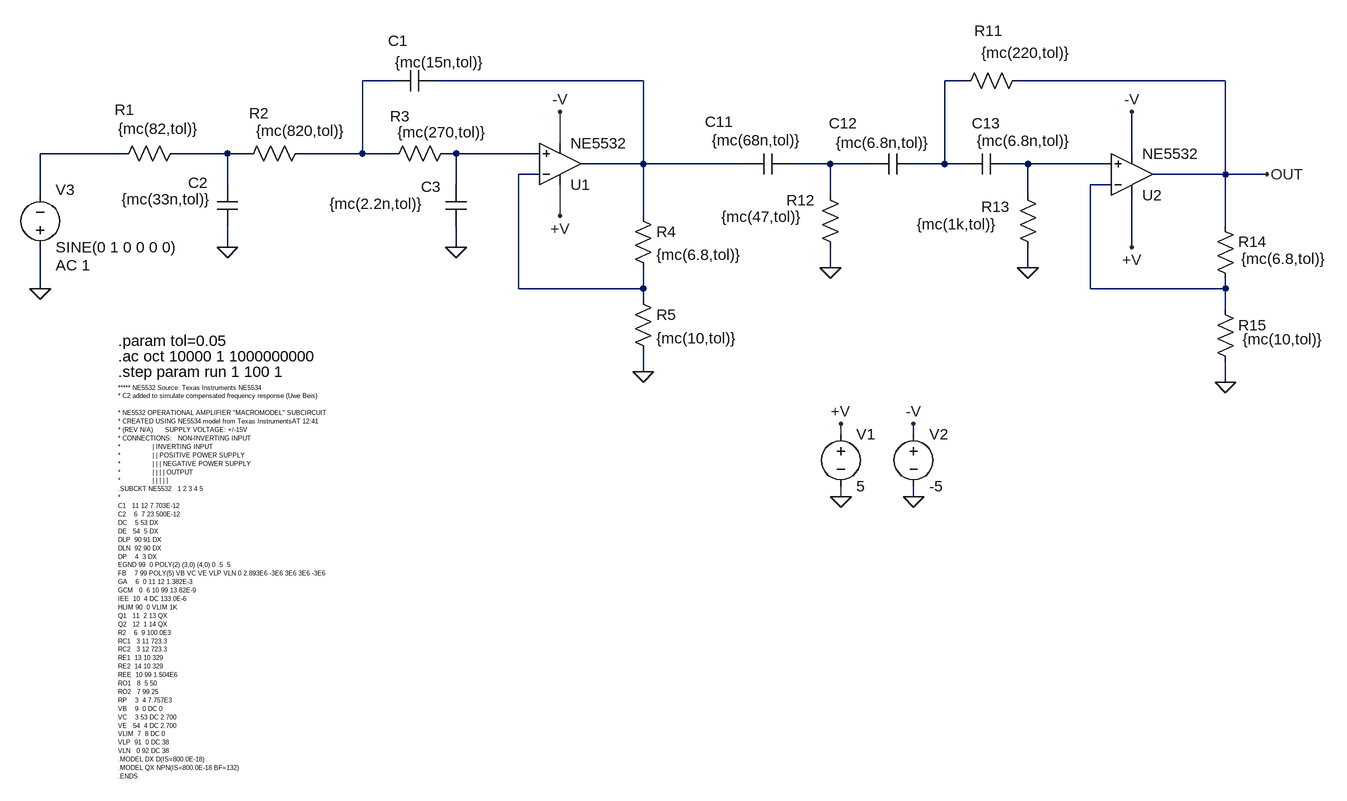
[diagram p0: schematic sallen-key-bp.asc]
sallen-key-bp.asc, the LTspice schematic file:
Version 4
SHEET 1 1432 1664
WIRE -80 -112 -128 -112
WIRE 304 -112 -16 -112
WIRE 800 -112 768 -112
WIRE 1200 -112 880 -112
WIRE 176 -16 176 -64
WIRE -496 0 -624 0
WIRE -336 0 -416 0
WIRE -304 0 -336 0
WIRE -128 0 -128 -112
WIRE -128 0 -224 0
WIRE -80 0 -128 0
WIRE 16 0 0 0
WIRE 144 0 16 0
WIRE 1056 0 1056 -64
WIRE 304 16 304 -112
WIRE 304 16 208 16
WIRE 464 16 304 16
WIRE 592 16 528 16
WIRE 656 16 592 16
WIRE 768 16 768 -112
WIRE 768 16 720 16
WIRE 800 16 768 16
WIRE 896 16 864 16
WIRE 1024 16 896 16
WIRE 144 32 112 32
WIRE 1200 32 1200 -112
WIRE 1200 32 1088 32
WIRE 1264 32 1200 32
WIRE -336 48 -336 0
WIRE 16 48 16 0
WIRE 1024 48 992 48
WIRE -624 64 -624 0
WIRE 592 64 592 16
WIRE 896 64 896 16
WIRE 176 96 176 48
WIRE 304 96 304 16
WIRE 1200 112 1200 32
WIRE -336 144 -336 112
WIRE 16 144 16 112
WIRE 1056 144 1056 64
WIRE 592 176 592 144
WIRE 896 176 896 144
WIRE -624 208 -624 144
WIRE 112 208 112 32
WIRE 304 208 304 176
WIRE 304 208 112 208
WIRE 992 208 992 48
WIRE 1200 208 1200 192
WIRE 1200 208 992 208
WIRE 304 224 304 208
WIRE 1200 240 1200 208
WIRE 304 336 304 304
WIRE 1200 352 1200 320
WIRE 608 432 608 416
WIRE 720 432 720 416
WIRE 608 528 608 512
WIRE 720 528 720 512
FLAG 608 528 0
FLAG 608 416 +V
FLAG 720 528 0
FLAG 720 416 -V
FLAG -624 208 0
FLAG 1264 32 OUT
FLAG 16 144 0
FLAG -336 144 0
FLAG 592 176 0
FLAG 896 176 0
FLAG 1056 144 +V
FLAG 1056 -64 -V
FLAG 1200 352 0
FLAG 304 336 0
FLAG 176 -64 -V
FLAG 176 96 +V
SYMBOL voltage 608 416 R0
SYMATTR InstName V1
SYMATTR Value 5
SYMBOL voltage -624 160 M180
WINDOW 0 24 104 Left 2
WINDOW 3 24 16 Left 2
WINDOW 123 24 -12 Left 2
WINDOW 39 0 0 Left 0
SYMATTR InstName V3
SYMATTR Value SINE(0 1 0 0 0 0)
SYMATTR Value2 AC 1
SYMBOL voltage 720 416 R0
SYMATTR InstName V2
SYMATTR Value -5
SYMBOL res -400 -16 R90
WINDOW 0 -36 94 VBottom 2
WINDOW 3 -38 42 VTop 2
SYMATTR InstName R1
SYMATTR Value {mc(82,tol)}
SYMBOL res -208 -16 R90
WINDOW 0 -30 79 VBottom 2
WINDOW 3 -35 15 VTop 2
SYMATTR InstName R2
SYMATTR Value {mc(820,tol)}
SYMBOL cap -320 112 R180
WINDOW 0 46 67 Left 2
WINDOW 3 41 42 Left 2
SYMATTR InstName C2
SYMATTR Value {mc(33n,tol)}
SYMBOL cap -16 -128 R90
WINDOW 0 -30 57 VBottom 2
WINDOW 3 -28 -7 VTop 2
SYMATTR InstName C1
SYMATTR Value {mc(15n,tol)}
SYMBOL res 16 -16 R90
WINDOW 0 -26 86 VBottom 2
WINDOW 3 -32 21 VTop 2
SYMATTR InstName R3
SYMATTR Value {mc(270,tol)}
SYMBOL cap 0 48 R0
WINDOW 0 -38 3 Left 2
WINDOW 3 -179 29 Left 2
SYMATTR InstName C3
SYMATTR Value {mc(2.2n,tol)}
SYMBOL cap 528 0 R90
WINDOW 0 -33 107 VBottom 2
WINDOW 3 -36 49 VTop 2
SYMATTR InstName C11
SYMATTR Value {mc(68n,tol)}
SYMBOL cap 720 0 R90
WINDOW 0 -31 108 VBottom 2
WINDOW 3 -32 47 VTop 2
SYMATTR InstName C12
SYMATTR Value {mc(6.8n,tol)}
SYMBOL res 576 48 R0
WINDOW 0 -52 24 Left 2
WINDOW 3 -152 49 Left 2
SYMATTR InstName R12
SYMATTR Value {mc(47,tol)}
SYMBOL res 880 48 R0
WINDOW 0 -56 34 Left 2
WINDOW 3 -155 61 Left 2
SYMATTR InstName R13
SYMATTR Value {mc(1k,tol)}
SYMBOL res 896 -128 R90
WINDOW 0 -45 60 VBottom 2
WINDOW 3 -43 3 VTop 2
SYMATTR InstName R11
SYMATTR Value {mc(220,tol)}
SYMBOL OpAmps\\opamp2 1056 96 M180
SYMATTR InstName U2
SYMATTR Value NE5532
SYMBOL res 1184 96 R0
WINDOW 3 40 66 Left 2
SYMATTR InstName R14
SYMATTR Value {mc(6.8,tol)}
SYMBOL res 1184 224 R0
WINDOW 3 43 62 Left 2
SYMATTR InstName R15
SYMATTR Value {mc(10,tol)}
SYMBOL OpAmps\\opamp2 176 80 M180
SYMATTR InstName U1
SYMATTR Value NE5532
SYMBOL res 288 80 R0
SYMATTR InstName R4
SYMATTR Value {mc(6.8,tol)}
SYMBOL res 288 208 R0
SYMATTR InstName R5
SYMATTR Value {mc(10,tol)}
SYMBOL cap 864 0 R90
WINDOW 0 -31 32 VBottom 2
WINDOW 3 -35 -26 VTop 2
SYMATTR InstName C13
SYMATTR Value {mc(6.8n,tol)}
TEXT -504 312 Left 2 !.ac oct 10000 1 1000000000
TEXT -504 360 Left 0 !***** NE5532 Source: Texas Instruments NE5534\n* C2 added to simulate compensated frequency response (Uwe Beis)\n \n* NE5532 OPERATIONAL AMPLIFIER "MACROMODEL" SUBCIRCUIT\n* CREATED USING NE5534 model from Texas InstrumentsAT 12:41\n* (REV N/A)      SUPPLY VOLTAGE: +/-15V\n* CONNECTIONS:   NON-INVERTING INPUT\n*                | INVERTING INPUT\n*                | | POSITIVE POWER SUPPLY\n*                | | | NEGATIVE POWER SUPPLY\n*                | | | | OUTPUT\n*                | | | | |\n.SUBCKT NE5532   1 2 3 4 5\n*\nC1   11 12 7.703E-12\nC2    6  7 23.500E-12\nDC    5 53 DX\nDE   54  5 DX\nDLP  90 91 DX\nDLN  92 90 DX\nDP    4  3 DX\nEGND 99  0 POLY(2) (3,0) (4,0) 0 .5 .5\nFB    7 99 POLY(5) VB VC VE VLP VLN 0 2.893E6 -3E6 3E6 3E6 -3E6\nGA    6  0 11 12 1.382E-3\nGCM   0  6 10 99 13.82E-9\nIEE  10  4 DC 133.0E-6\nHLIM 90  0 VLIM 1K\nQ1   11  2 13 QX\nQ2   12  1 14 QX\nR2    6  9 100.0E3\nRC1   3 11 723.3\nRC2   3 12 723.3\nRE1  13 10 329\nRE2  14 10 329\nREE  10 99 1.504E6\nRO1   8  5 50\nRO2   7 99 25\nRP    3  4 7.757E3\nVB    9  0 DC 0\nVC    3 53 DC 2.700\nVE   54  4 DC 2.700\nVLIM  7  8 DC 0\nVLP  91  0 DC 38\nVLN   0 92 DC 38\n.MODEL DX D(IS=800.0E-18)\n.MODEL QX NPN(IS=800.0E-18 BF=132)\n.ENDS
TEXT -504 288 Left 2 !.param tol=0.05
TEXT -504 336 Left 2 !.step param run 1 100 1

The netlist it stands for:
* sallen-key-bp.asc
V1 +V 0 5
V3 0 N004 SINE(0 1 0 0 0 0) AC 1
V2 -V 0 -5
R1 N005 N004 {mc(82,tol)}
R2 N001 N005 {mc(820,tol)}
C2 0 N005 {mc(33n,tol)}
C1 N002 N001 {mc(15n,tol)}
R3 N006 N001 {mc(270,tol)}
C3 N006 0 {mc(2.2n,tol)}
C11 N007 N002 {mc(68n,tol)}
C12 N003 N007 {mc(6.8n,tol)}
R12 N007 0 {mc(47,tol)}
R13 N008 0 {mc(1k,tol)}
R11 OUT N003 {mc(220,tol)}
XU2 N008 N010 +V -V OUT NE5532  ; pins In+ In- V+ V- OUT
R14 OUT N010 {mc(6.8,tol)}
R15 N010 0 {mc(10,tol)}
XU1 N006 N009 +V -V N002 NE5532  ; pins In+ In- V+ V- OUT
R4 N002 N009 {mc(6.8,tol)}
R5 N009 0 {mc(10,tol)}
C13 N008 N003 {mc(6.8n,tol)}
.ac oct 10000 1 1000000000
***** NE5532 Source: Texas Instruments NE5534
* C2 added to simulate compensated frequency response (Uwe Beis)
* NE5532 OPERATIONAL AMPLIFIER "MACROMODEL" SUBCIRCUIT
* CREATED USING NE5534 model from Texas InstrumentsAT 12:41
* (REV N/A)      SUPPLY VOLTAGE: +/-15V
* CONNECTIONS:   NON-INVERTING INPUT
*                | INVERTING INPUT
*                | | POSITIVE POWER SUPPLY
*                | | | NEGATIVE POWER SUPPLY
*                | | | | OUTPUT
*                | | | | |
.SUBCKT NE5532   1 2 3 4 5
*
C1   11 12 7.703E-12
C2    6  7 23.500E-12
DC    5 53 DX
DE   54  5 DX
DLP  90 91 DX
DLN  92 90 DX
DP    4  3 DX
EGND 99  0 POLY(2) (3,0) (4,0) 0 .5 .5
FB    7 99 POLY(5) VB VC VE VLP VLN 0 2.893E6 -3E6 3E6 3E6 -3E6
GA    6  0 11 12 1.382E-3
GCM   0  6 10 99 13.82E-9
IEE  10  4 DC 133.0E-6
HLIM 90  0 VLIM 1K
Q1   11  2 13 QX
Q2   12  1 14 QX
R2    6  9 100.0E3
RC1   3 11 723.3
RC2   3 12 723.3
RE1  13 10 329
RE2  14 10 329
REE  10 99 1.504E6
RO1   8  5 50
RO2   7 99 25
RP    3  4 7.757E3
VB    9  0 DC 0
VC    3 53 DC 2.700
VE   54  4 DC 2.700
VLIM  7  8 DC 0
VLP  91  0 DC 38
VLN   0 92 DC 38
.MODEL DX D(IS=800.0E-18)
.MODEL QX NPN(IS=800.0E-18 BF=132)
.ENDS
.param tol=0.05
.step param run 1 100 1
.backanno
.end